# EAGLE schematic MAIN_BQ_INDUCTOR_REV (EAGLE 9.6.2)
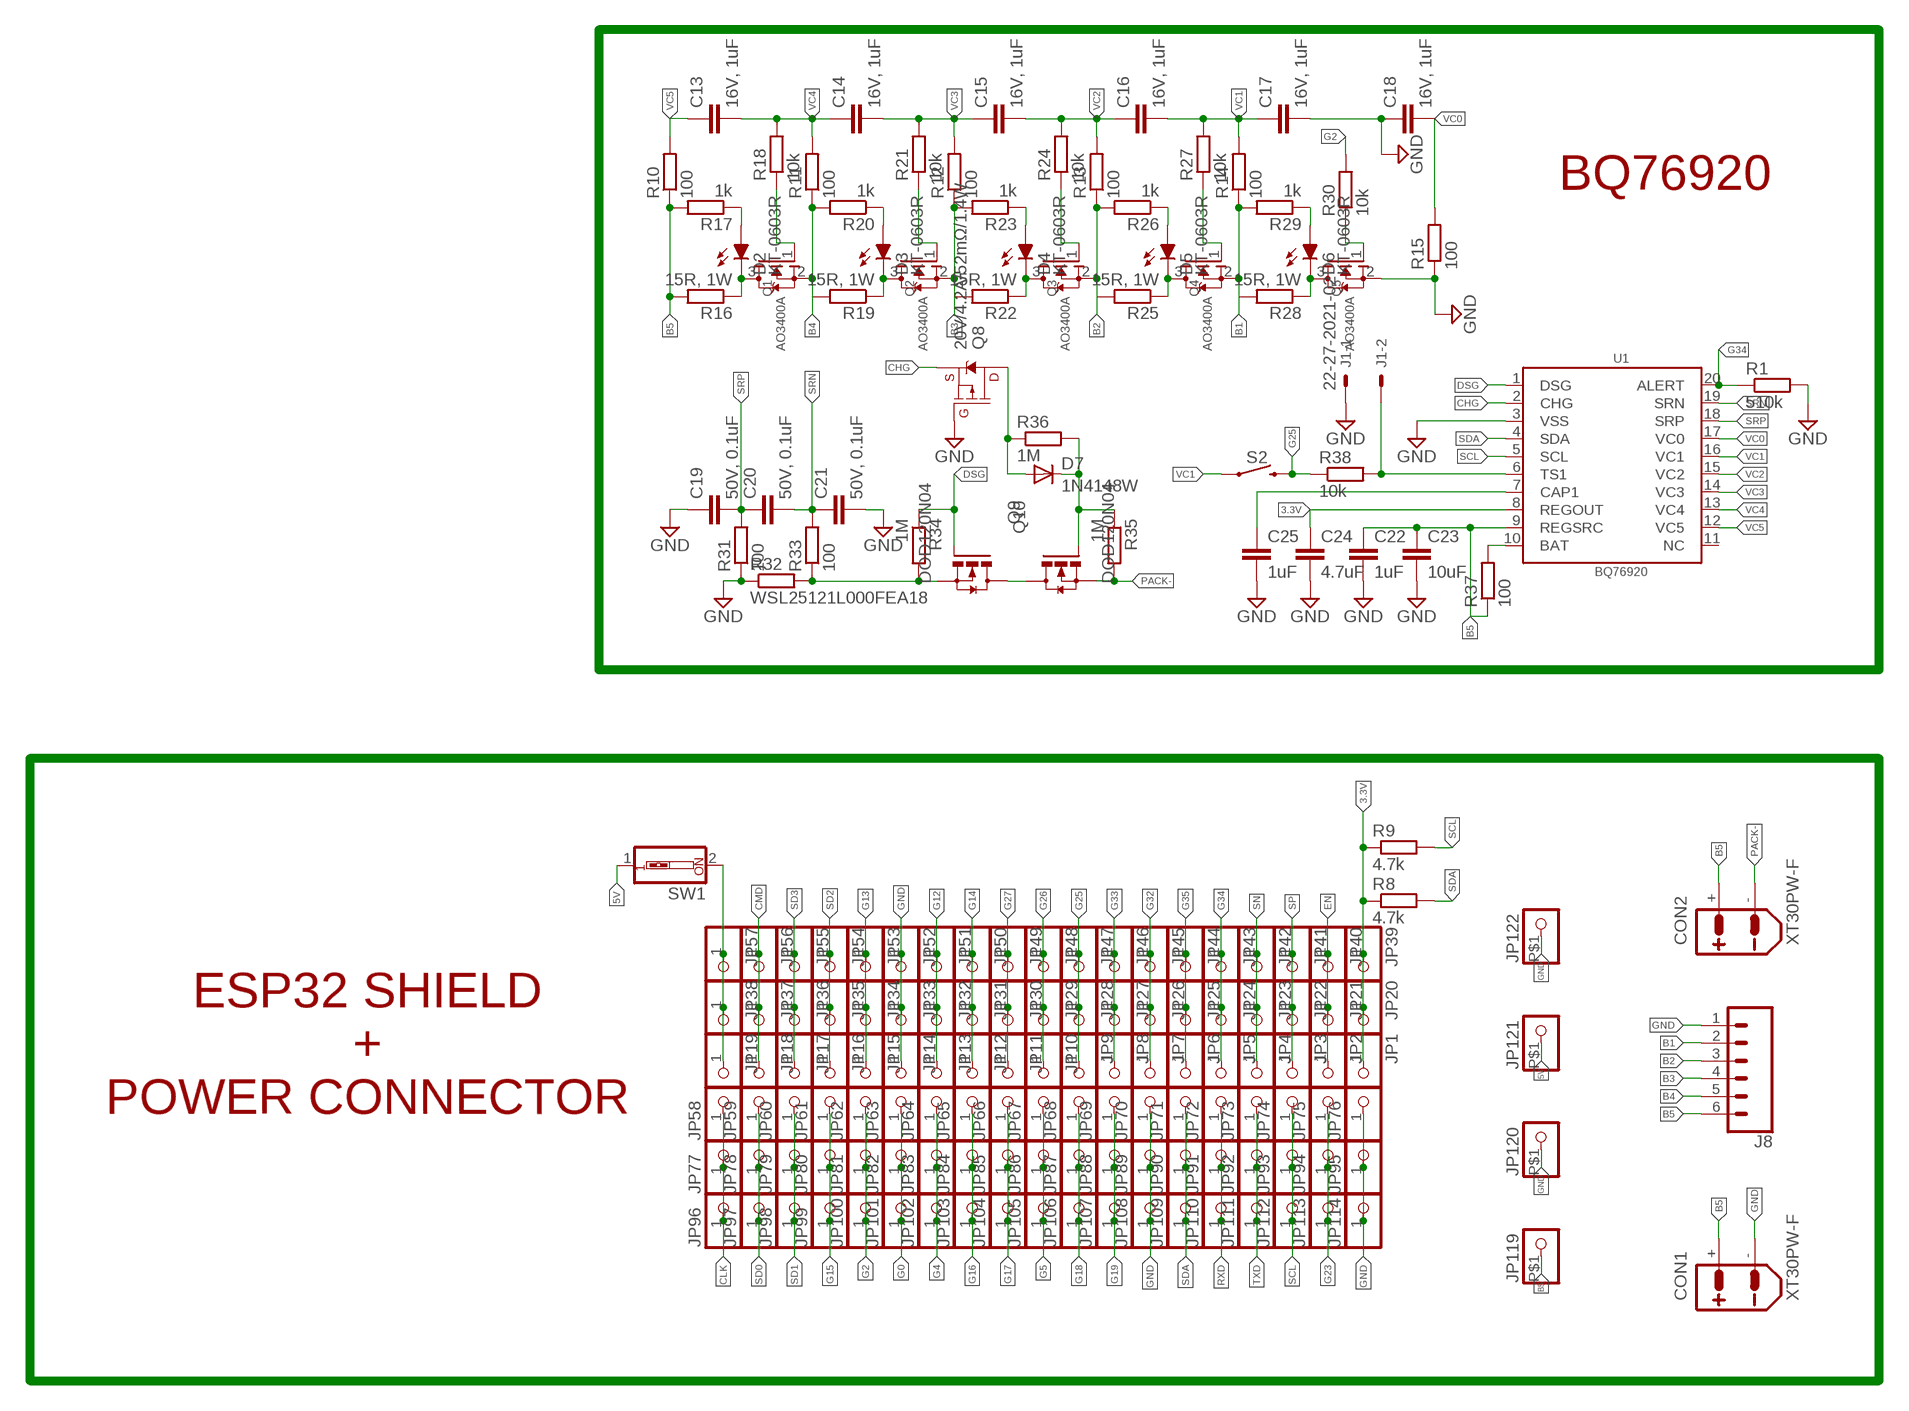
[diagram p0: schematic, sheet 1, part 1 of 2]
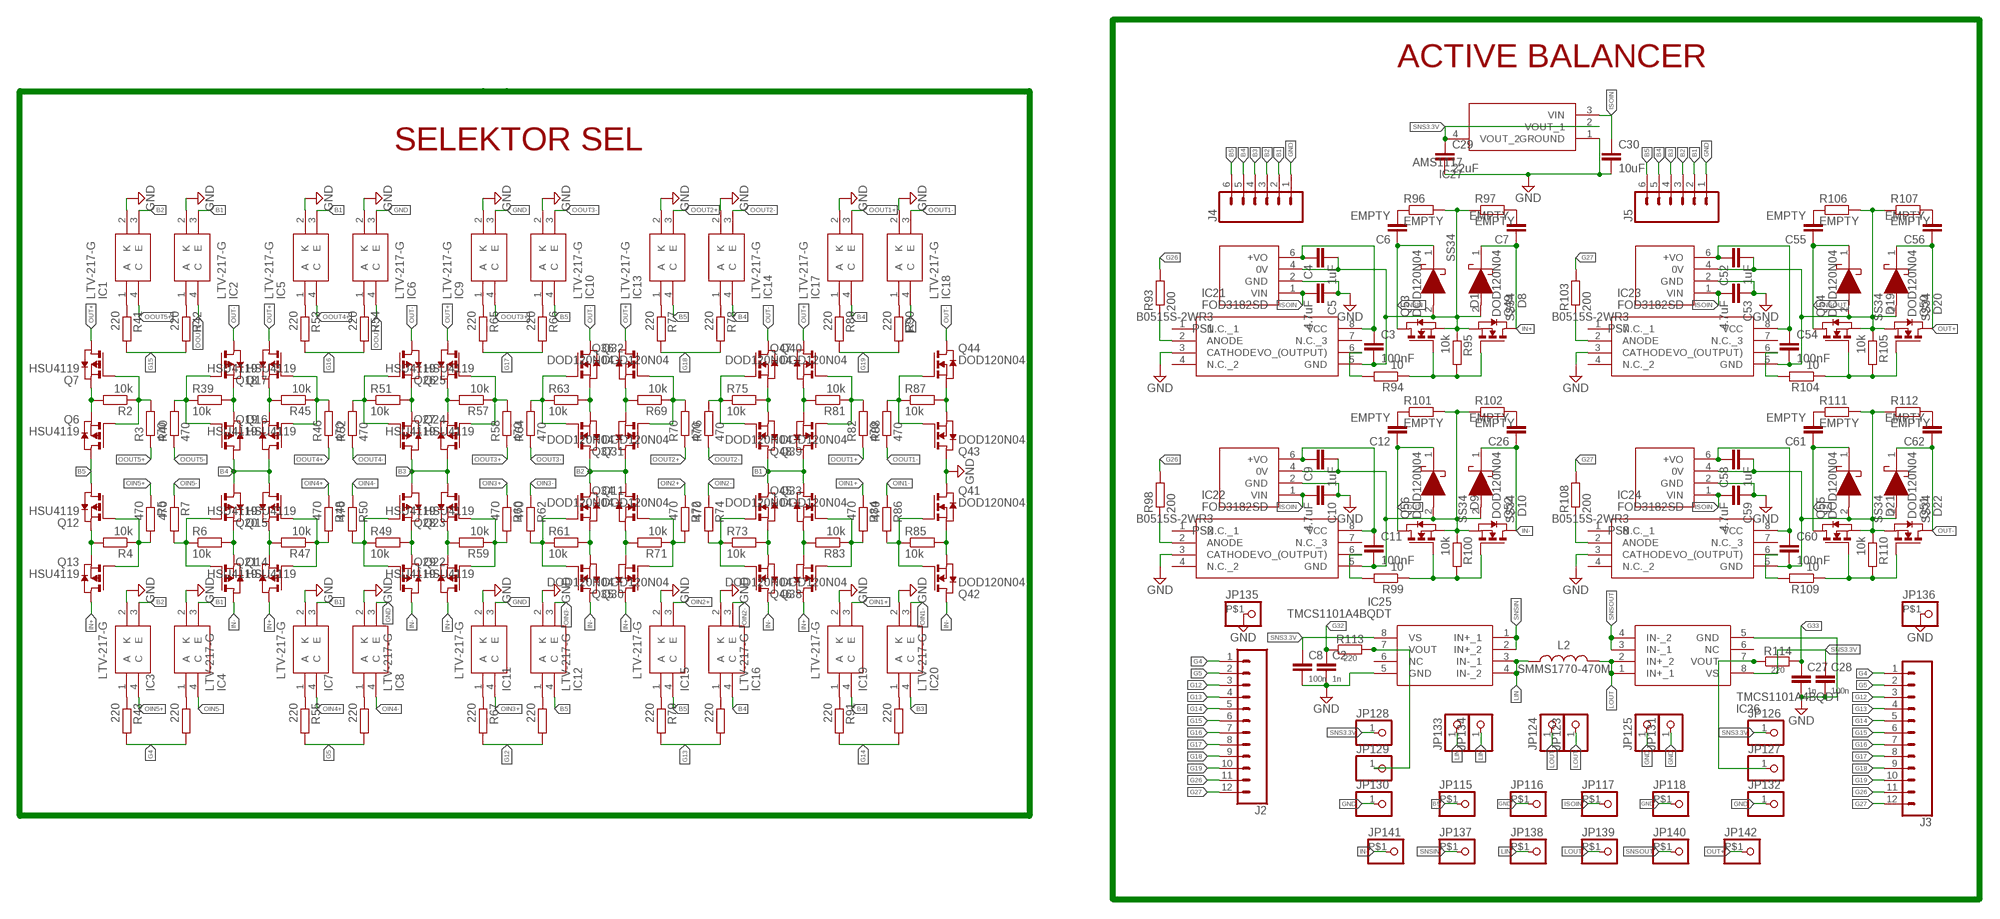
[diagram p1: schematic, sheet 1, part 2 of 2]

## Parts
C2  1n  C-EUC0805  [C0805]
C3  100nF  C-EUC0805  [C0805]
C4  1uF  C-EUC1206  [C1206]
C5  4.7uF  C-EUC1206  [C1206]
C6  EMPTY  C-EUC1206  [C1206]
C7  EMPTY  C-EUC1206  [C1206]
C8  100n  C-EUC0805  [C0805]
C9  1uF  C-EUC1206  [C1206]
C10  4.7uF  C-EUC1206  [C1206]
C11  100nF  C-EUC0805  [C0805]
C12  EMPTY  C-EUC1206  [C1206]
C13  16V, 1uF  C-EUC0805  [C0805]
C14  16V, 1uF  C-EUC0805  [C0805]
C15  16V, 1uF  C-EUC0805  [C0805]
C16  16V, 1uF  C-EUC0805  [C0805]
C17  16V, 1uF  C-EUC0805  [C0805]
C18  16V, 1uF  C-EUC0805  [C0805]
C19  50V, 0.1uF  C-EUC0603  [C0603]
C20  50V, 0.1uF  C-EUC0603  [C0603]
C21  50V, 0.1uF  C-EUC0603  [C0603]
C22  1uF  C-EUC0805  [C0805]
C23  10uF  C-EUC1206  [C1206]
C24  4.7uF  C-EUC0805  [C0805]
C25  1uF  C-EUC0805  [C0805]
C26  EMPTY  C-EUC1206  [C1206]
C27  1n  C-EUC0805  [C0805]
C28  100n  C-EUC0805  [C0805]
C29  22uF  C-EUC0805  [C0805]
C30  10uF  C-EUC0805  [C0805]
C52  1uF  C-EUC1206  [C1206]
C53  4.7uF  C-EUC1206  [C1206]
C54  100nF  C-EUC0805  [C0805]
C55  EMPTY  C-EUC1206  [C1206]
C56  EMPTY  C-EUC1206  [C1206]
C58  1uF  C-EUC1206  [C1206]
C59  4.7uF  C-EUC1206  [C1206]
C60  100nF  C-EUC0805  [C0805]
C61  EMPTY  C-EUC1206  [C1206]
C62  EMPTY  C-EUC1206  [C1206]
CON1  XT30PW-F  [XT30PW-F]
CON2  XT30PW-F  [XT30PW-F]
D1  SS34  [DIOM6959X262N]
D2  KT-0603R  LED_LEDCHIP-LED0603MP  [LED_CHIP-LED0603MP]
D3  KT-0603R  LED_LEDCHIP-LED0603MP  [LED_CHIP-LED0603MP]
D4  KT-0603R  LED_LEDCHIP-LED0603MP  [LED_CHIP-LED0603MP]
D5  KT-0603R  LED_LEDCHIP-LED0603MP  [LED_CHIP-LED0603MP]
D6  KT-0603R  LED_LEDCHIP-LED0603MP  [LED_CHIP-LED0603MP]
D7  1N4148W  DIODESOD-123  [SOD-123]
D8  SS34  [DIOM6959X262N]
D9  SS34  [DIOM6959X262N]
D10  SS34  [DIOM6959X262N]
D19  SS34  [DIOM6959X262N]
D20  SS34  [DIOM6959X262N]
D21  SS34  [DIOM6959X262N]
D22  SS34  [DIOM6959X262N]
IC1  LTV-217-G  [LTV217G]
IC2  LTV-217-G  [LTV217G]
IC3  LTV-217-G  [LTV217G]
IC4  LTV-217-G  [LTV217G]
IC5  LTV-217-G  [LTV217G]
IC6  LTV-217-G  [LTV217G]
IC7  LTV-217-G  [LTV217G]
IC8  LTV-217-G  [LTV217G]
IC9  LTV-217-G  [LTV217G]
IC10  LTV-217-G  [LTV217G]
IC11  LTV-217-G  [LTV217G]
IC12  LTV-217-G  [LTV217G]
IC13  LTV-217-G  [LTV217G]
IC14  LTV-217-G  [LTV217G]
IC15  LTV-217-G  [LTV217G]
IC16  LTV-217-G  [LTV217G]
IC17  LTV-217-G  [LTV217G]
IC18  LTV-217-G  [LTV217G]
IC19  LTV-217-G  [LTV217G]
IC20  LTV-217-G  [LTV217G]
IC21  FOD3182SD  TLP350_TP5,F_  [SOP254P1000X400-8N]
IC22  FOD3182SD  TLP350_TP5,F_  [SOP254P1000X400-8N]
IC23  FOD3182SD  TLP350_TP5,F_  [SOP254P1000X400-8N]
IC24  FOD3182SD  TLP350_TP5,F_  [SOP254P1000X400-8N]
IC25  TMCS1101A4BQDT  [SOIC127P600X175-8N]
IC26  TMCS1101A4BQDT  [SOIC127P600X175-8N]
IC27  AMS1117  [SOT229P700X180-4N]
J1  22-27-2021-02  [6410-02]
J2  CONN_12  [1X12]
J3  CONN_12  [1X12]
J4  CONN_06LONGPADS  [1X06_LONGPADS]
J5  CONN_06LONGPADS  [1X06_LONGPADS]
J8  CONN_06LONGPADS  [1X06_LONGPADS]
JP1  PINHD-1X1  [1X01]
JP2  PINHD-1X1  [1X01]
JP3  PINHD-1X1  [1X01]
JP4  PINHD-1X1  [1X01]
JP5  PINHD-1X1  [1X01]
JP6  PINHD-1X1  [1X01]
JP7  PINHD-1X1  [1X01]
JP8  PINHD-1X1  [1X01]
JP9  PINHD-1X1  [1X01]
JP10  PINHD-1X1  [1X01]
JP11  PINHD-1X1  [1X01]
JP12  PINHD-1X1  [1X01]
JP13  PINHD-1X1  [1X01]
JP14  PINHD-1X1  [1X01]
JP15  PINHD-1X1  [1X01]
JP16  PINHD-1X1  [1X01]
JP17  PINHD-1X1  [1X01]
JP18  PINHD-1X1  [1X01]
JP19  PINHD-1X1  [1X01]
JP20  PINHD-1X1  [1X01]
JP21  PINHD-1X1  [1X01]
JP22  PINHD-1X1  [1X01]
JP23  PINHD-1X1  [1X01]
JP24  PINHD-1X1  [1X01]
JP25  PINHD-1X1  [1X01]
JP26  PINHD-1X1  [1X01]
JP27  PINHD-1X1  [1X01]
JP28  PINHD-1X1  [1X01]
JP29  PINHD-1X1  [1X01]
JP30  PINHD-1X1  [1X01]
JP31  PINHD-1X1  [1X01]
JP32  PINHD-1X1  [1X01]
JP33  PINHD-1X1  [1X01]
JP34  PINHD-1X1  [1X01]
JP35  PINHD-1X1  [1X01]
JP36  PINHD-1X1  [1X01]
JP37  PINHD-1X1  [1X01]
JP38  PINHD-1X1  [1X01]
JP39  PINHD-1X1  [1X01]
JP40  PINHD-1X1  [1X01]
JP41  PINHD-1X1  [1X01]
JP42  PINHD-1X1  [1X01]
JP43  PINHD-1X1  [1X01]
JP44  PINHD-1X1  [1X01]
JP45  PINHD-1X1  [1X01]
JP46  PINHD-1X1  [1X01]
JP47  PINHD-1X1  [1X01]
JP48  PINHD-1X1  [1X01]
JP49  PINHD-1X1  [1X01]
JP50  PINHD-1X1  [1X01]
JP51  PINHD-1X1  [1X01]
JP52  PINHD-1X1  [1X01]
JP53  PINHD-1X1  [1X01]
JP54  PINHD-1X1  [1X01]
JP55  PINHD-1X1  [1X01]
JP56  PINHD-1X1  [1X01]
JP57  PINHD-1X1  [1X01]
JP58  PINHD-1X1  [1X01]
JP59  PINHD-1X1  [1X01]
JP60  PINHD-1X1  [1X01]
JP61  PINHD-1X1  [1X01]
JP62  PINHD-1X1  [1X01]
JP63  PINHD-1X1  [1X01]
JP64  PINHD-1X1  [1X01]
JP65  PINHD-1X1  [1X01]
JP66  PINHD-1X1  [1X01]
JP67  PINHD-1X1  [1X01]
JP68  PINHD-1X1  [1X01]
JP69  PINHD-1X1  [1X01]
JP70  PINHD-1X1  [1X01]
JP71  PINHD-1X1  [1X01]
JP72  PINHD-1X1  [1X01]
JP73  PINHD-1X1  [1X01]
JP74  PINHD-1X1  [1X01]
JP75  PINHD-1X1  [1X01]
JP76  PINHD-1X1  [1X01]
JP77  PINHD-1X1  [1X01]
JP78  PINHD-1X1  [1X01]
JP79  PINHD-1X1  [1X01]
JP80  PINHD-1X1  [1X01]
JP81  PINHD-1X1  [1X01]
JP82  PINHD-1X1  [1X01]
JP83  PINHD-1X1  [1X01]
JP84  PINHD-1X1  [1X01]
JP85  PINHD-1X1  [1X01]
JP86  PINHD-1X1  [1X01]
JP87  PINHD-1X1  [1X01]
JP88  PINHD-1X1  [1X01]
JP89  PINHD-1X1  [1X01]
JP90  PINHD-1X1  [1X01]
JP91  PINHD-1X1  [1X01]
JP92  PINHD-1X1  [1X01]
JP93  PINHD-1X1  [1X01]
JP94  PINHD-1X1  [1X01]
JP95  PINHD-1X1  [1X01]
JP96  PINHD-1X1  [1X01]
JP97  PINHD-1X1  [1X01]
JP98  PINHD-1X1  [1X01]
JP99  PINHD-1X1  [1X01]
JP100  PINHD-1X1  [1X01]
JP101  PINHD-1X1  [1X01]
JP102  PINHD-1X1  [1X01]
JP103  PINHD-1X1  [1X01]
JP104  PINHD-1X1  [1X01]
JP105  PINHD-1X1  [1X01]
JP106  PINHD-1X1  [1X01]
JP107  PINHD-1X1  [1X01]
JP108  PINHD-1X1  [1X01]
JP109  PINHD-1X1  [1X01]
JP110  PINHD-1X1  [1X01]
JP111  PINHD-1X1  [1X01]
JP112  PINHD-1X1  [1X01]
JP113  PINHD-1X1  [1X01]
JP114  PINHD-1X1  [1X01]
JP115  PINHD-1X1-BIGPOGO  [1X1-BIGPOGO]
JP116  PINHD-1X1-BIGPOGO  [1X1-BIGPOGO]
JP117  PINHD-1X1-BIGPOGO  [1X1-BIGPOGO]
JP118  PINHD-1X1-BIGPOGO  [1X1-BIGPOGO]
JP119  PINHD-1X1-BIGPOGO  [1X1-BIGPOGO]
JP120  PINHD-1X1-BIGPOGO  [1X1-BIGPOGO]
JP121  PINHD-1X1-BIGPOGO  [1X1-BIGPOGO]
JP122  PINHD-1X1-BIGPOGO  [1X1-BIGPOGO]
JP123  PINHD-1X1  [1X01]
JP124  PINHD-1X1  [1X01]
JP125  PINHD-1X1  [1X01]
JP126  PINHD-1X1  [1X01]
JP127  PINHD-1X1  [1X01]
JP128  PINHD-1X1  [1X01]
JP129  PINHD-1X1  [1X01]
JP130  PINHD-1X1  [1X01]
JP131  PINHD-1X1  [1X01]
JP132  PINHD-1X1  [1X01]
JP133  PINHD-1X1  [1X01]
JP134  PINHD-1X1  [1X01]
JP135  PINHD-1X1-BIGPOGO  [1X1-BIGPOGO]
JP136  PINHD-1X1-BIGPOGO  [1X1-BIGPOGO]
JP137  PINHD-1X1-BIGPOGO  [1X1-BIGPOGO]
JP138  PINHD-1X1-BIGPOGO  [1X1-BIGPOGO]
JP139  PINHD-1X1-BIGPOGO  [1X1-BIGPOGO]
JP140  PINHD-1X1-BIGPOGO  [1X1-BIGPOGO]
JP141  PINHD-1X1-BIGPOGO  [1X1-BIGPOGO]
JP142  PINHD-1X1-BIGPOGO  [1X1-BIGPOGO]
L2  SMMS1770-470M  INDUCTOR471PA4344  [PA4344-17X17]
PS1  B0515S-2WR3  B1212S-2WR3  [B1212S2WR3]
PS2  B0515S-2WR3  B1212S-2WR3  [B1212S2WR3]
PS7  B0515S-2WR3  B1212S-2WR3  [B1212S2WR3]
PS8  B0515S-2WR3  B1212S-2WR3  [B1212S2WR3]
Q1  AO3400A  MOSFET-NREFLOW  [SOT23]
Q2  AO3400A  MOSFET-NREFLOW  [SOT23]
Q3  AO3400A  MOSFET-NREFLOW  [SOT23]
Q4  AO3400A  MOSFET-NREFLOW  [SOT23]
Q5  AO3400A  MOSFET-NREFLOW  [SOT23]
Q6  HSU4119  PMOS-DPAK  [TO252]
Q7  HSU4119  PMOS-DPAK  [TO252]
Q8  20V/4.2A/52mΩ/1.4W  MOSFET_PCH-DMG2305UX-7  [SOT23-3]
Q9  DOD120N04  STD35NF06T4  [DPAK]
Q10  DOD120N04  STD35NF06T4  [DPAK]
Q11  DOD120N04  NMOS-TO252  [TO252]
Q12  HSU4119  PMOS-DPAK  [TO252]
Q13  HSU4119  PMOS-DPAK  [TO252]
Q14  HSU4119  PMOS-DPAK  [TO252]
Q15  HSU4119  PMOS-DPAK  [TO252]
Q16  HSU4119  PMOS-DPAK  [TO252]
Q17  HSU4119  PMOS-DPAK  [TO252]
Q18  HSU4119  PMOS-DPAK  [TO252]
Q19  HSU4119  PMOS-DPAK  [TO252]
Q20  HSU4119  PMOS-DPAK  [TO252]
Q21  HSU4119  PMOS-DPAK  [TO252]
Q22  HSU4119  PMOS-DPAK  [TO252]
Q23  HSU4119  PMOS-DPAK  [TO252]
Q24  HSU4119  PMOS-DPAK  [TO252]
Q25  HSU4119  PMOS-DPAK  [TO252]
Q26  HSU4119  PMOS-DPAK  [TO252]
Q27  HSU4119  PMOS-DPAK  [TO252]
Q28  HSU4119  PMOS-DPAK  [TO252]
Q29  HSU4119  PMOS-DPAK  [TO252]
Q30  DOD120N04  NMOS-TO252  [TO252]
Q31  DOD120N04  NMOS-TO252  [TO252]
Q32  DOD120N04  NMOS-TO252  [TO252]
Q33  DOD120N04  NMOS-TO252  [TO252]
Q34  DOD120N04  NMOS-TO252  [TO252]
Q35  DOD120N04  NMOS-TO252  [TO252]
Q36  DOD120N04  NMOS-TO252  [TO252]
Q37  DOD120N04  NMOS-TO252  [TO252]
Q38  DOD120N04  NMOS-TO252  [TO252]
Q39  DOD120N04  NMOS-TO252  [TO252]
Q40  DOD120N04  NMOS-TO252  [TO252]
Q41  DOD120N04  NMOS-TO252  [TO252]
Q42  DOD120N04  NMOS-TO252  [TO252]
Q43  DOD120N04  NMOS-TO252  [TO252]
Q44  DOD120N04  NMOS-TO252  [TO252]
Q45  DOD120N04  NMOS-TO252  [TO252]
Q46  DOD120N04  NMOS-TO252  [TO252]
Q47  DOD120N04  NMOS-TO252  [TO252]
Q48  DOD120N04  NMOS-TO252  [TO252]
Q49  DOD120N04  NMOS-TO252  [TO252]
Q50  DOD120N04  NMOS-TO252  [TO252]
Q51  DOD120N04  NMOS-TO252  [TO252]
Q52  DOD120N04  NMOS-TO252  [TO252]
Q53  DOD120N04  NMOS-TO252  [TO252]
Q54  DOD120N04  NMOS-TO252  [TO252]
Q55  DOD120N04  NMOS-TO252  [TO252]
Q56  DOD120N04  NMOS-TO252  [TO252]
R1  510k  R-EU_R0603  [R0603]
R2  10k  R-EU_R0805  [R0805]
R3  470  R-EU_R0805  [R0805]
R4  10k  R-EU_R0805  [R0805]
R5  470  R-EU_R0805  [R0805]
R6  10k  R-EU_R0805  [R0805]
R7  470  R-EU_R0805  [R0805]
R8  4.7k  R-EU_R0402  [R0402]
R9  4.7k  R-EU_R0402  [R0402]
R10  100  R-EU_R1206  [R1206]
R11  100  R-EU_R1206  [R1206]
R12  100  R-EU_R1206  [R1206]
R13  100  R-EU_R1206  [R1206]
R14  100  R-EU_R1206  [R1206]
R15  100  R-EU_R1206  [R1206]
R16  15R, 1W  R-EU_R2512  [R2512]
R17  1k  R-EU_R0402  [R0402]
R18  10k  R-EU_R0402  [R0402]
R19  15R, 1W  R-EU_R2512  [R2512]
R20  1k  R-EU_R0402  [R0402]
R21  10k  R-EU_R0402  [R0402]
R22  15R, 1W  R-EU_R2512  [R2512]
R23  1k  R-EU_R0402  [R0402]
R24  10k  R-EU_R0402  [R0402]
R25  15R, 1W  R-EU_R2512  [R2512]
R26  1k  R-EU_R0402  [R0402]
R27  10k  R-EU_R0402  [R0402]
R28  15R, 1W  R-EU_R2512  [R2512]
R29  1k  R-EU_R0402  [R0402]
R30  10k  R-EU_R0402  [R0402]
R31  100  R-EU_R0805  [R0805]
R32  WSL25121L000FEA18  R-EU_R2512  [R2512]
R33  100  R-EU_R0805  [R0805]
R34  1M  R-EU_R0805  [R0805]
R35  1M  R-EU_R0805  [R0805]
R36  1M  R-EU_R0805  [R0805]
R37  100  R-EU_R1206  [R1206]
R38  10k  R-EU_R0402  [R0402]
R39  10k  R-EU_R0805  [R0805]
R40  470  R-EU_R0805  [R0805]
R41  220  R-EU_R0805  [R0805]
R42  220  R-EU_R0805  [R0805]
R43  220  R-EU_R0805  [R0805]
R44  220  R-EU_R0805  [R0805]
R45  10k  R-EU_R0805  [R0805]
R46  470  R-EU_R0805  [R0805]
R47  10k  R-EU_R0805  [R0805]
R48  470  R-EU_R0805  [R0805]
R49  10k  R-EU_R0805  [R0805]
R50  470  R-EU_R0805  [R0805]
R51  10k  R-EU_R0805  [R0805]
R52  470  R-EU_R0805  [R0805]
R53  220  R-EU_R0805  [R0805]
R54  220  R-EU_R0805  [R0805]
R55  220  R-EU_R0805  [R0805]
R56  220  R-EU_R0805  [R0805]
R57  10k  R-EU_R0805  [R0805]
R58  470  R-EU_R0805  [R0805]
R59  10k  R-EU_R0805  [R0805]
R60  470  R-EU_R0805  [R0805]
R61  10k  R-EU_R0805  [R0805]
R62  470  R-EU_R0805  [R0805]
R63  10k  R-EU_R0805  [R0805]
R64  470  R-EU_R0805  [R0805]
R65  220  R-EU_R0805  [R0805]
R66  220  R-EU_R0805  [R0805]
R67  220  R-EU_R0805  [R0805]
R68  220  R-EU_R0805  [R0805]
R69  10k  R-EU_R0805  [R0805]
R70  470  R-EU_R0805  [R0805]
R71  10k  R-EU_R0805  [R0805]
R72  470  R-EU_R0805  [R0805]
R73  10k  R-EU_R0805  [R0805]
R74  470  R-EU_R0805  [R0805]
R75  10k  R-EU_R0805  [R0805]
R76  470  R-EU_R0805  [R0805]
R77  220  R-EU_R0805  [R0805]
R78  220  R-EU_R0805  [R0805]
R79  220  R-EU_R0805  [R0805]
R80  220  R-EU_R0805  [R0805]
R81  10k  R-EU_R0805  [R0805]
R82  470  R-EU_R0805  [R0805]
R83  10k  R-EU_R0805  [R0805]
R84  470  R-EU_R0805  [R0805]
R85  10k  R-EU_R0805  [R0805]
R86  470  R-EU_R0805  [R0805]
R87  10k  R-EU_R0805  [R0805]
R88  470  R-EU_R0805  [R0805]
R89  220  R-EU_R0805  [R0805]
R90  220  R-EU_R0805  [R0805]
R91  220  R-EU_R0805  [R0805]
R92  220  R-EU_R0805  [R0805]
R93  200  R-EU_R0805  [R0805]
R94  10  R-EU_R1206  [R1206]
R95  10k  R-EU_R0805  [R0805]
R96  EMPTY  R-EU_R1206  [R1206]
R97  EMPTY  R-EU_R1206  [R1206]
R98  200  R-EU_R0805  [R0805]
R99  10  R-EU_R1206  [R1206]
R100  10k  R-EU_R0805  [R0805]
R101  EMPTY  R-EU_R1206  [R1206]
R102  EMPTY  R-EU_R1206  [R1206]
R103  200  R-EU_R0805  [R0805]
R104  10  R-EU_R1206  [R1206]
R105  10k  R-EU_R0805  [R0805]
R106  EMPTY  R-EU_R1206  [R1206]
R107  EMPTY  R-EU_R1206  [R1206]
R108  200  R-EU_R0805  [R0805]
R109  10  R-EU_R1206  [R1206]
R110  10k  R-EU_R0805  [R0805]
R111  EMPTY  R-EU_R1206  [R1206]
R112  EMPTY  R-EU_R1206  [R1206]
R113  220  R-EU_R0805  [R0805]
R114  220  R-EU_R0805  [R0805]
S2  MOMENTARY-SWITCH-SPST-SMD-5.2-TALL-REDUNDANT  [TACTILE_SWITCH_SMD_5.2MM]
SW1  SW_DIP-1  [EDG-01]
U1  BQ76920  [TSSOP-20_4.4X6.5MM_PITCH0.65MM]

## Nets
3.3V: C24.1 JP1.1 JP20.1 JP39.1 R8.1 R9.1 U1.8(REGOUT)
5V: JP121.P$1 SW1.1
B1: IC2.3(E) IC4.3(E) IC5.3(E) IC7.3(E) J4.2 J5.2 J8.2 Q4.2(S) Q33.D Q39.D Q45.D Q48.D R14.1 R28.2 R29.2
B2: IC1.3(E) IC3.3(E) J4.3 J5.3 J8.3 Q3.2(S) Q11.D Q31.D Q34.D Q37.D R13.1 R25.2 R26.2
B3: IC18.4(C) IC20.4(C) J4.4 J5.4 J8.4 Q2.2(S) Q23.D Q24.D Q27.D Q28.D R12.1 R22.2 R23.2
B4: IC14.4(C) IC16.4(C) IC17.4(C) IC19.4(C) J4.5 J5.5 J8.5 Q1.2(S) Q15.D Q16.D Q19.D Q20.D R11.1 R19.2 R20.2
B5: C22.1 C23.1 CON1.+ CON2.+ IC10.4(C) IC12.4(C) IC13.4(C) IC15.4(C) J4.6 J5.6 J8.6 JP115.P$1 JP119.P$1 Q6.D Q12.D R10.1 R16.2 R17.2 R37.1 U1.9(REGSRC)
CHG: Q8.2(S) U1.2(CHG)
CLK: JP58.1 JP77.1 JP96.1
CMD: JP18.1 JP37.1 JP56.1
DSG: Q9.1(G) R34.1 U1.1(DSG)
EN: JP2.1 JP21.1 JP40.1
G0: JP63.1 JP82.1 JP101.1
G2: JP62.1 JP81.1 JP100.1 R30.2
G4: J2.1 J3.1 JP64.1 JP83.1 JP102.1 R43.2 R44.2
G5: J2.2 J3.2 JP67.1 JP86.1 JP105.1 R55.2 R56.2
G12: J2.3 J3.3 JP13.1 JP32.1 JP51.1 R67.2 R68.2
G13: J2.4 J3.4 JP15.1 JP34.1 JP53.1 R79.2 R80.2
G14: J2.5 J3.5 JP12.1 JP31.1 JP50.1 R91.2 R92.2
G15: J2.6 J3.6 JP61.1 JP80.1 JP99.1 R41.2 R42.2
G16: J2.7 J3.7 JP65.1 JP84.1 JP103.1 R53.2 R54.2
G17: J2.8 J3.8 JP66.1 JP85.1 JP104.1 R65.2 R66.2
G18: J2.9 J3.9 JP68.1 JP87.1 JP106.1 R77.2 R78.2
G19: J2.10 J3.10 JP69.1 JP88.1 JP107.1 R89.2 R90.2
G23: JP75.1 JP94.1 JP113.1
G25: JP9.1 JP28.1 JP47.1 R38.1 S2.3 S2.4
G26: J2.11 J3.11 JP10.1 JP29.1 JP48.1 R93.2 R98.2
G27: J2.12 J3.12 JP11.1 JP30.1 JP49.1 R103.2 R108.2
G32: C2.1 JP7.1 JP26.1 JP45.1 R113.1
G33: C27.1 JP8.1 JP27.1 JP46.1 R114.2
G34: JP5.1 JP24.1 JP43.1 R1.1 U1.20(ALERT)
G35: JP6.1 JP25.1 JP44.1
GND: C2.2 C5.1 C8.2 C10.1 C17.2 C18.1 C19.1 C21.2 C22.2 C23.2 C24.2 C25.2 C27.2 C28.2 C29.2 C30.2 C53.1 C59.1 CON1.- IC1.2(K) IC2.2(K) IC3.2(K) IC4.2(K) IC5.2(K) IC6.2(K) IC6.3(E) IC7.2(K) IC8.2(K) IC8.3(E) IC9.2(K) IC9.3(E) IC10.2(K) IC11.2(K) IC11.3(E) IC12.2(K) IC13.2(K) IC14.2(K) IC15.2(K) IC16.2(K) IC17.2(K) IC18.2(K) IC19.2(K) IC20.2(K) IC21.3(CATHODE) IC22.3(CATHODE) IC23.3(CATHODE) IC24.3(CATHODE) IC25.5(GND) IC26.5(GND) IC27.1(GROUND) J1.1 J4.1 J5.1 J8.1 JP14.1 JP33.1 JP52.1 JP70.1 JP76.1 JP89.1 JP95.1 JP108.1 JP114.1 JP116.P$1 JP118.P$1 JP120.P$1 JP122.P$1 JP125.1 JP130.1 JP131.1 JP132.1 JP135.P$1 JP136.P$1 PS1.2(GND) PS2.2(GND) PS7.2(GND) PS8.2(GND) Q5.2(S) Q8.1(G) Q41.D Q43.D R1.2 R15.1 R31.1 R32.1 U1.3(VSS)
IN+: C7.1 D8.1(K) Q13.D Q21.D Q29.D Q35.D Q46.D Q49.D
IN-: C26.1 D10.1(K) JP141.P$1 Q14.D Q22.D Q30.D Q38.D Q42.D Q52.D
ISOIN: C5.2 C10.2 C30.1 C53.2 C59.2 IC27.3(VIN) JP117.P$1 PS1.1(VIN) PS2.1(VIN) PS7.1(VIN) PS8.1(VIN)
LIN: C61.1 D21.1(K) IC25.3(IN-_1) IC25.4(IN-_2) JP133.1 JP134.1 JP138.P$1 L2.1 Q55.D
LOUT: C12.1 D9.1(K) IC26.1(IN+_1) IC26.2(IN+_2) JP123.1 JP124.1 JP139.P$1 L2.2 Q56.D
N$1: Q12.G Q13.G R4.1 R5.2
N$2: Q6.G Q7.G R2.1 R3.2
N$3: Q12.S Q13.S R4.2
N$4: Q6.S Q7.S R2.2
N$5: Q26.G Q27.G R57.1 R58.2
N$6: Q14.G Q15.G R6.1 R7.2
N$7: Q14.S Q15.S R6.2
N$8: Q16.G Q17.G R39.1 R40.2
N$9: Q16.S Q17.S R39.2
N$10: Q26.S Q27.S R57.2
N$11: IC21.6(VO_(OUTPUT)) R94.2
N$12: JP19.1 JP38.1 JP57.1 SW1.2
N$13: D7.A Q8.3(D) R36.1
N$14: Q9.3(S) R32.2 R33.1 R34.2
N$16: C3.1 C4.1 IC21.8(VCC) PS1.6(+VO)
N$17: Q9.2(D) Q10.2(D)
N$18: R37.2 U1.10(BAT)
N$19: IC21.2(ANODE) R93.1
N$20: C3.2 C4.2 D1.2(A) D8.2(A) IC21.5(GND) PS1.4(0V) Q49.S Q53.S R95.1 R96.2 R97.1
N$21: Q49.G Q53.G R94.1 R95.2
N$22: C6.2 R96.1
N$23: IC1.1(A) R41.1
N$24: IC2.1(A) R42.1
N$25: C7.2 R97.2
N$26: IC22.6(VO_(OUTPUT)) R99.2
N$27: D7.C Q10.1(G) R35.1 R36.2
N$28: IC3.1(A) R43.1
N$29: C9.1 C11.1 IC22.8(VCC) PS2.6(+VO)
N$30: IC4.1(A) R44.1
N$31: IC22.2(ANODE) R98.1
N$32: J1.2 R38.2 U1.6(TS1)
N$33: C25.1 U1.7(CAP1)
N$34: C9.2 C11.2 D9.2(A) D10.2(A) IC22.5(GND) PS2.4(0V) Q52.S Q56.S R100.1 R101.2 R102.1
N$35: Q52.G Q56.G R99.1 R100.2
N$36: Q18.G Q19.G R45.1 R46.2
N$37: Q18.S Q19.S R45.2
N$38: Q20.G Q21.G R47.1 R48.2
N$39: Q20.S Q21.S R47.2
N$40: Q28.G Q29.G R59.1 R60.2
N$41: Q22.G Q23.G R49.1 R50.2
N$42: Q22.S Q23.S R49.2
N$43: D2.C Q1.3(D) R16.1
N$44: D2.A R17.1
N$45: Q1.1(G) R18.1
N$46: D3.C Q2.3(D) R19.1
N$47: D3.A R20.1
N$48: Q2.1(G) R21.1
N$49: D4.C Q3.3(D) R22.1
N$50: D4.A R23.1
N$51: Q3.1(G) R24.1
N$52: D5.C Q4.3(D) R25.1
N$53: D5.A R26.1
N$54: Q4.1(G) R27.1
N$55: D6.C Q5.3(D) R28.1
N$56: D6.A R29.1
N$57: Q5.1(G) R30.1
N$58: Q24.G Q25.G R51.1 R52.2
N$59: Q24.S Q25.S R51.2
N$60: Q36.G Q37.G R69.1 R70.2
N$61: C12.2 R101.1
N$62: C26.2 R102.2
N$63: IC5.1(A) R53.1
N$64: C52.1 C54.1 IC23.8(VCC) PS7.6(+VO)
N$65: IC6.1(A) R54.1
N$66: IC23.2(ANODE) R103.1
N$67: IC7.1(A) R55.1
N$68: IC8.1(A) R56.1
N$69: Q50.G Q54.G R104.1 R105.2
N$70: Q51.G Q55.G R109.1 R110.2
N$71: C61.2 R111.1
N$72: C62.2 R112.2
N$73: IC25.7(VOUT) JP129.1 R113.2
N$76: IC26.7(VOUT) JP127.1 R114.1
N$77: Q28.S Q29.S R59.2
N$78: Q36.S Q37.S R69.2
N$79: Q11.G Q30.G R61.1 R62.2
N$80: Q11.S Q30.S R61.2
N$81: Q31.G Q32.G R63.1 R64.2
N$82: Q31.S Q32.S R63.2
N$83: Q47.G Q48.G R81.1 R82.2
N$85: IC23.6(VO_(OUTPUT)) R104.2
N$86: IC9.1(A) R65.1
N$88: IC10.1(A) R66.1
N$89: C52.2 C54.2 D19.2(A) D20.2(A) IC23.5(GND) PS7.4(0V) Q50.S Q54.S R105.1 R106.2 R107.1
N$90: IC11.1(A) R67.1
N$91: IC12.1(A) R68.1
N$92: C55.2 R106.1
N$93: C56.2 R107.2
N$95: IC24.6(VO_(OUTPUT)) R109.2
N$96: C58.1 C60.1 IC24.8(VCC) PS8.6(+VO)
N$98: IC24.2(ANODE) R108.1
N$99: C58.2 C60.2 D21.2(A) D22.2(A) IC24.5(GND) PS8.4(0V) Q51.S Q55.S R110.1 R111.2 R112.1
N$100: Q34.G Q35.G R71.1 R72.2
N$101: Q34.S Q35.S R71.2
N$102: Q33.G Q38.G R73.1 R74.2
N$103: Q33.S Q38.S R73.2
N$104: Q39.G Q40.G R75.1 R76.2
N$105: Q39.S Q40.S R75.2
N$109: IC13.1(A) R77.1
N$111: IC14.1(A) R78.1
N$113: IC15.1(A) R79.1
N$114: IC16.1(A) R80.1
N$123: Q47.S Q48.S R81.2
N$124: Q45.G Q46.G R83.1 R84.2
N$125: Q45.S Q46.S R83.2
N$126: Q41.G Q42.G R85.1 R86.2
N$127: Q41.S Q42.S R85.2
N$128: Q43.G Q44.G R87.1 R88.2
N$129: Q43.S Q44.S R87.2
N$133: IC17.1(A) R89.1
N$135: IC18.1(A) R90.1
N$137: IC19.1(A) R91.1
N$138: IC20.1(A) R92.1
OIN1+: IC19.3(E) R84.1
OIN1-: IC20.3(E) R86.1
OIN2+: IC15.3(E) R72.1
OIN2-: IC16.3(E) R74.1
OIN3+: IC11.4(C) R60.1
OIN3-: IC12.3(E) R62.1
OIN4+: IC7.4(C) R48.1
OIN4-: IC8.4(C) R50.1
OIN5+: IC3.4(C) R5.1
OIN5-: IC4.4(C) R7.1
OOUT1+: IC17.3(E) R82.1
OOUT1-: IC18.3(E) R88.1
OOUT2+: IC13.3(E) R70.1
OOUT2-: IC14.3(E) R76.1
OOUT3+: IC9.4(C) R58.1
OOUT3-: IC10.3(E) R64.1
OOUT4+: IC5.4(C) R46.1
OOUT4-: IC6.4(C) R52.1
OOUT5+: IC1.4(C) R3.1
OOUT5-: IC2.4(C) R40.1
OUT+: C56.1 D20.1(K) JP142.P$1 Q7.D Q18.D Q26.D Q36.D Q47.D Q50.D
OUT-: C62.1 D22.1(K) Q17.D Q25.D Q32.D Q40.D Q44.D Q51.D
PACK-: CON2.- Q10.3(S) R35.2
RXD: JP72.1 JP91.1 JP110.1
SCL: JP74.1 JP93.1 JP112.1 R9.2 U1.5(SCL)
SD0: JP59.1 JP78.1 JP97.1
SD1: JP60.1 JP79.1 JP98.1
SD2: JP16.1 JP35.1 JP54.1
SD3: JP17.1 JP36.1 JP55.1
SDA: JP71.1 JP90.1 JP109.1 R8.2 U1.4(SDA)
SN: JP4.1 JP23.1 JP42.1
SNS3.3V: C8.1 C28.1 C29.1 IC25.8(VS) IC26.8(VS) IC27.2(VOUT_1) IC27.4(VOUT_2) JP126.1 JP128.1
SNSIN: C6.1 D1.1(K) IC25.1(IN+_1) IC25.2(IN+_2) JP137.P$1 Q53.D
SNSOUT: C55.1 D19.1(K) IC26.3(IN-_1) IC26.4(IN-_2) JP140.P$1 Q54.D
SP: JP3.1 JP22.1 JP41.1
SRN: C20.2 C21.1 R33.2 U1.19(SRN)
SRP: C19.2 C20.1 R31.2 U1.18(SRP)
TXD: JP73.1 JP92.1 JP111.1
VC0: C18.2 R15.2 U1.17(VC0)
VC1: C16.2 C17.1 R14.2 R27.2 S2.1 S2.2 U1.16(VC1)
VC2: C15.2 C16.1 R13.2 R24.2 U1.15(VC2)
VC3: C14.2 C15.1 R12.2 R21.2 U1.14(VC3)
VC4: C13.2 C14.1 R11.2 R18.2 U1.13(VC4)
VC5: C13.1 R10.2 U1.12(VC5)
Unconnected: IC21.1(N.C._1) IC21.4(N.C._2) IC21.7(N.C._3) IC22.1(N.C._1) IC22.4(N.C._2) IC22.7(N.C._3) IC23.1(N.C._1) IC23.4(N.C._2) IC23.7(N.C._3) IC24.1(N.C._1) IC24.4(N.C._2) IC24.7(N.C._3) IC25.6(NC) IC26.6(NC) U1.11(NC)

## Notes on the sheet
- ACTIVE BALANCER
- BQ76920
- SELEKTOR SEL
- ESP32 SHIELD
  +
  POWER CONNECTOR

## Library data of the parts
C2 C8 C19-C21 C27 C28 = rcl:C-EU: CAPACITOR, European symbol
C3-C7 C9-C18 C22-C26 C29 C30 C52-C56 C58-C62 = rcl:C-EU: CAPACITOR, European symbol; SPICEPREFIX: C
CON1 CON2 = amass:XT30: AMASS XT30 connector Store in Japan AMASS XT30 connector <https://szc.jp/ams-xt30>
D1 D8-D10 D19-D22 = SamacSys_Parts:SS34: HY Electronic Corp SS34, SMT Schottky Diode, 40V 3A, 2-Pin DO-214AB Source: Datasheet <http://www.hygroup.com.tw/upfiles/ADUpload/all_/SS32 thru SS310(242-243).pdf>; DESCRIPTION: HY Electronic Corp SS34, SMT Schottky Diode, 40V 3A, 2-Pin DO-214AB; HEIGHT: 2.62mm; MANUFACTURER_NAME: HY Electronic; MANUFACTURER_PART_NUMBER: SS34
D2-D6 = 52101-101-REV-A_v16:LED_LED: LED Various Types
D7 = adafruit:DIODE: Diode SMADIODE - SMA Surface Mount Package 20V 1A Schottky Diode Digikey: 641-1014-6-ND DO-1N4148 - Through Hole Small Current Diode SOD-123 20V 1 A (.5mV Vf) Schottky Diode - Digikey: MBRX120TPMSCT-ND SOD-323 10V 570mA (.38mV Vf, 3ns) Schottky Diode - Digikey: ZLLS410CT-ND SOD-523 30V 30mA Schottky Diode (RB751S-40TE61) - Digikey: RB751S-40TE61CT-ND SOT23-R/W - SOT23 Package (R = Solder Paste/Reflow Ovens, W = Hand-Soldering) BAT54Film 40V 300mA - Digikey: 497-7162-1-ND
IC1-IC20 = SamacSys_Parts:LTV-217-G: Transistor Output Optocouplers Optocoupler, AC 600%, 5KV, 4 PIN Source: Datasheet <https://optoelectronics.liteon.com/upload/download/DS70-2009-0016/LTV-2X7 sereis 201610.pdf>; ARROW_PART_NUMBER: LTV-217-G; ARROW_PRICE-STOCK: https://www.arrow.com/en/products/ltv-217-g/lite-on-technology?region=nac; DESCRIPTION: Transistor Output Optocouplers Optocoupler, AC 600%, 5KV, 4 PIN; HEIGHT: 2.42mm; MANUFACTURER_NAME: Lite-On; MANUFACTURER_PART_NUMBER: LTV-217-G; MOUSER_PART_NUMBER: 859-LTV217G; MOUSER_PRICE-STOCK: https://www.mouser.co.uk/ProductDetail/Lite-On/LTV-217-G?qs=U5SWHfT1b2nEvPNnCoZraQ%3D%3D
IC21-IC24 = SamacSys_Parts:TLP350_TP5,F_: Toshiba TLP350(TP5,F) DC Input Dual Optocoupler, Surface Mount, 8-Pin PDIP Source: Datasheet <http://toshiba.semicon-storage.com/info/docget.jsp?did=6217&prodName=TLP350>; ARROW_PART_NUMBER: TLP350(TP5,F); ARROW_PRICE-STOCK: https://www.arrow.com/en/products/tlp350-tp5f/toshiba; DESCRIPTION: Toshiba TLP350(TP5,F) DC Input Dual Optocoupler, Surface Mount, 8-Pin PDIP; HEIGHT: 4mm; MANUFACTURER_NAME: Toshiba; MANUFACTURER_PART_NUMBER: TLP350(TP5,F)
IC25 IC26 = SamacSys_Parts:TMCS1101A4BQDT: Board Mount Current Sensors Precision isolated current sensor with internal reference 8-SOIC -40 to 125 Source: Datasheet <http://www.ti.com/general/docs/lit/getliterature.tsp?genericPartNumber=TMCS1101&fileType=pdf>; ARROW_PART_NUMBER: TMCS1101A4BQDT; ARROW_PRICE-STOCK: https://www.arrow.com/en/products/tmcs1101a4bqdt/texas-instruments?utm_currency=USD&region=nac; DESCRIPTION: Board Mount Current Sensors Precision isolated current sensor with internal reference 8-SOIC -40 to 125; HEIGHT: 1.75mm; MANUFACTURER_NAME: Texas Instruments; MANUFACTURER_PART_NUMBER: TMCS1101A4BQDT; MOUSER_PART_NUMBER: 595-TMCS1101A4BQDT; MOUSER_PRICE-STOCK: https://www.mouser.co.uk/ProductDetail/Texas-Instruments/TMCS1101A4BQDT?qs=sPbYRqrBIVkjLpOps1NVGQ%3D%3D
IC27 = SamacSys_Parts:AMS1117: 1117 Source: Datasheet <https://datasheet.lcsc.com/szlcsc/Advanced-Monolithic-Systems-AMS-AMS1117-ADJ_C6188.pdf>; DESCRIPTION: 1117; HEIGHT: 1.8mm; MANUFACTURER_NAME: Advanced Monolithic Systems; MANUFACTURER_PART_NUMBER: AMS1117
J1 = con-molex:22-?-02: CONNECTOR wire to board 2.54 mm (.1 inch) pitch header; MF: MOLEX; OC_FARNELL: unknown; OC_NEWARK: unknown
J2 J3 = SparkFun-Connectors:CONN_12: Multi connection point. Often used as Generic Header-pin footprint for 0.1 inch spaced/style header connections On any of the 0.1 inch spaced packages, you can populate with these: Break Away Headers - Straight <https://www.sparkfun.com/products/116> (PRT-00116) Break Away Male Headers - Right Angle <https://www.sparkfun.com/products/553> (PRT-00553) Female Headers <https://www.sparkfun.com/products/115> (PRT-00115) Break Away Headers - Machine Pin <https://www.sparkfun.com/products/117> (PRT-00117) Break Away Female Headers - Swiss Machine Pin <https://www.sparkfun.com/products/743> (PRT-00743) For SCREWTERMINALS and SPRING TERMINALS visit here: Screw Terimnals on SparkFun.com <https://www.sparkfun.com/search/results?term=Screw+Terminals> (5mm/3.5mm/2.54mm spacing) This device is also useful as a general connection point to wire up your design to another part of your project. Our various solder wires solder well into these plated through hole pads. Hook-Up Wire - Assortment (Stranded, 22 AWG) <https://www.sparkfun.com/products/11375> (PRT-11375) Hook-Up Wire - Assortment (Solid Core, 22 AWG) <https://www.sparkfun.com/products/11367> (PRT-11367) View the entire wire category on our website here <https://www.sparkfun.com/categories/141> Special notes: Molex polarized connector foot print use with SKU : PRT-08231 with associated crimp pins and housings. 1MM SMD Version SKU: PRT-10208 NOTES ON THE VARIANTS LOCK and LOCK_LONGPADS... This footprint was designed to help hold the alignment of a through-hole component (i.e. 6-pin header) while soldering it into place. You may notice that each hole has been shifted either up or down by 0.005 of an inch from it's more standard position (which is a perfectly straight line). This slight alteration caused the pins (the squares in the middle) to touch the edges of the holes. Because they are alternating, it causes a "brace" to hold the component in place. 0.005 has proven to be the perfect amount of "off-center" position when using our standard breakaway headers. Although looks a little odd when you look at the bare footprint, once you have a header in there, the alteration is very hard to notice. Also,if you push a header all the way into place, it is covered up entirely on the bottom side.
J4 J5 J8 = SparkFun-Connectors:CONN_06: Multi connection point. Often used as Generic Header-pin footprint for 0.1 inch spaced/style header connections On any of the 0.1 inch spaced packages, you can populate with these: Break Away Headers - Straight <https://www.sparkfun.com/products/116> (PRT-00116) Break Away Male Headers - Right Angle <https://www.sparkfun.com/products/553> (PRT-00553) Female Headers <https://www.sparkfun.com/products/115> (PRT-00115) Break Away Headers - Machine Pin <https://www.sparkfun.com/products/117> (PRT-00117) Break Away Female Headers - Swiss Machine Pin <https://www.sparkfun.com/products/743> (PRT-00743) Arduino Stackable Header - 6 Pin <https://www.sparkfun.com/products/9280> (PRT-09280) Screw Terminals 2.54mm Pitch (6-Pin) <https://www.sparkfun.com/products/16499> (PRT-16499) For SCREWTERMINALS and SPRING TERMINALS visit here: Screw Terimnals on SparkFun.com <https://www.sparkfun.com/search/results?term=Screw+Terminals> (5mm/3.5mm/2.54mm spacing) This device is also useful as a general connection point to wire up your design to another part of your project. Our various solder wires solder well into these plated through hole pads. Hook-Up Wire - Assortment (Stranded, 22 AWG) <https://www.sparkfun.com/products/11375> (PRT-11375) Hook-Up Wire - Assortment (Solid Core, 22 AWG) <https://www.sparkfun.com/products/11367> (PRT-11367) View the entire wire category on our website here <https://www.sparkfun.com/categories/141>
JP1-JP142 = adafruit:PINHD-1X1: Pin header 1x1 for 0.1" spacing With round pins
L2 = inductors-smd:INDUCTOR: Power Inductor; MF: Pulse Electronics; MPN: PA4344.471ANLT
PS1 PS2 PS7 PS8 = SamacSys_Parts:B1212S-2WR3: Isolated Module DC DC Converter 1 Output 12V 167mA 10.8V - 13.2V Input Source: Datasheet <https://www.mornsun-power.com/public/uploads/pdf/B_S-2WR3.pdf>; DESCRIPTION: Isolated Module DC DC Converter 1 Output 12V 167mA 10.8V - 13.2V Input; HEIGHT: 10.41mm; MANUFACTURER_NAME: Mornsun Power; MANUFACTURER_PART_NUMBER: B1212S-2WR3
Q1-Q5 = adafruit:MOSFET-N: N-Channel Mosfet 2N7002E - 60V 260mA SOT23 [Digikey: 2N7002ET1GOSTR-ND] - REEL BSH103 - 30V 850mA SOT23 [Digikey: 568-5013-1-ND]
Q6 Q7 Q12-Q29 = MOSFET:PMOS: P-Channel MOSFET
Q8 = SparkFun-DiscreteSemi:MOSFET_PCH: P-channel MOSFETs Voltage controlled devices that allow control of high current outputs. SparkFun Products: SparkFun ESP32 Thing <https://www.sparkfun.com/products/13907> SparkFun ESP8266 Thing <https://www.sparkfun.com/products/13231> SparkFun Pi Servo HAT V2 <https://www.sparkfun.com/products/15316> DMG2305UX-7 (20V/4.2A/SOT23-3); PROD_ID: TRANS-14388
Q9 Q10 = Transistor:STD35NF06T4: MOSFET N-CH 60V 35A DPAK Manufacturer's datasheet <https://www.st.com/content/ccc/resource/technical/document/datasheet/0d/26/b9/23/e3/c0/49/5f/CD00002312.pdf/files/CD00002312.pdf/jcr:content/translations/en.CD00002312.pdf>; CREATED_BY: PCBLayout.com; DIGIKEY_PART_NUMBER: 497-STD35NF06T4CT-ND; MANUFACTURER: STMicroelectronics; MPN: STD35NF06T4; PACKAGE: DPAK
Q11 Q30-Q56 = MOSFET:NMOS: N-Channel MOSFET
R1-R16 R19 R22 R25 R28 R32 R34-R37 R39-R112 = rcl:R-EU_: RESISTOR, European symbol; SPICEPREFIX: R
R17 R18 R20 R21 R23 R24 R26 R27 R29-R31 R33 R38 R113 R114 = rcl:R-EU_: RESISTOR, European symbol
S2 = SparkFun-Switches:MOMENTARY-SWITCH-SPST: Momentary Switch (Pushbutton) - SPST Normally-open (NO) SPST momentary switches (buttons, pushbuttons). Variants PTH-12MM - 12mm square, through-hole Momentary Pushbutton Switch - 12mm Square <https://www.sparkfun.com/products/9190> (COM-09190) PTH-6.0MM, PTH-6.0MM-KIT - 6.0mm square, through-hole Mini Pushbutton Switch <https://www.sparkfun.com/products/97> (COM-00097) KIT package intended for soldering kit's - only one side of pads' copper is exposed. PTH-RIGHT-ANGLE-KIT - Right-angle, through-hole Right Angle Tactile Button <https://www.sparkfun.com/products/10791> - Used on SparkFun BigTime Watch Kit <https://www.sparkfun.com/products/11734> SMD-12MM - 12mm square, surface-mount Tactile Button - SMD (12mm) <https://www.sparkfun.com/products/12993> (COM-12993) Used on SparkFun PicoBoard <https://www.sparkfun.com/products/11888> SMD-4.5MM - 4.5mm Square Trackball Switch Used on SparkFun Blackberry Trackballer Breakout <https://www.sparkfun.com/products/13169> SMD-4.6MMX2.8MM - 4.60mm x 2.80mm, surface mount Used on SparkFun Pro Micro - RP2040 <https://www.sparkfun.com/products/17717> SMD-5.2MM, SMD-5.2-REDUNDANT - 5.2mm square, surface-mount Mini Pushbutton Switch - SMD <https://www.sparkfun.com/products/8720> (COM-08720) Used on Arduino Pro Mini <https://www.sparkfun.com/products/11114> REDUNDANT package connects both switch circuits together SMD-6.0X3.5MM - 6.0 x 3.5mm, surface mount Momentary Reset Switch SMD <https://www.sparkfun.com/products/8229> (COM-08229) SMD-6.2MM-TALL - 6.2mm square, surface mount Tactile Button - SMD (6mm) <https://www.sparkfun.com/products/12992> Used on SparkFun Digital Sandbox <https://www.sparkfun.com/products/12651> SMD-RIGHT-ANGLE - Right-angle, surface mount Used on SparkFun Block for Intel® Edison - Arduino <https://www.sparkfun.com/products/13036>; PROD_ID: SWCH-14139
SW1 = special:SW_DIP-1: DIP SWITCH
U1 = BQ76920:BQ76920